# Altium schematic sheet BLDC_Controller.SchDoc: BLDC Controller
size A4; Author: Ian Glass; DrawnBy: Ian Glass; Revision: 1; SheetNumber: 1; SheetTotal: 1
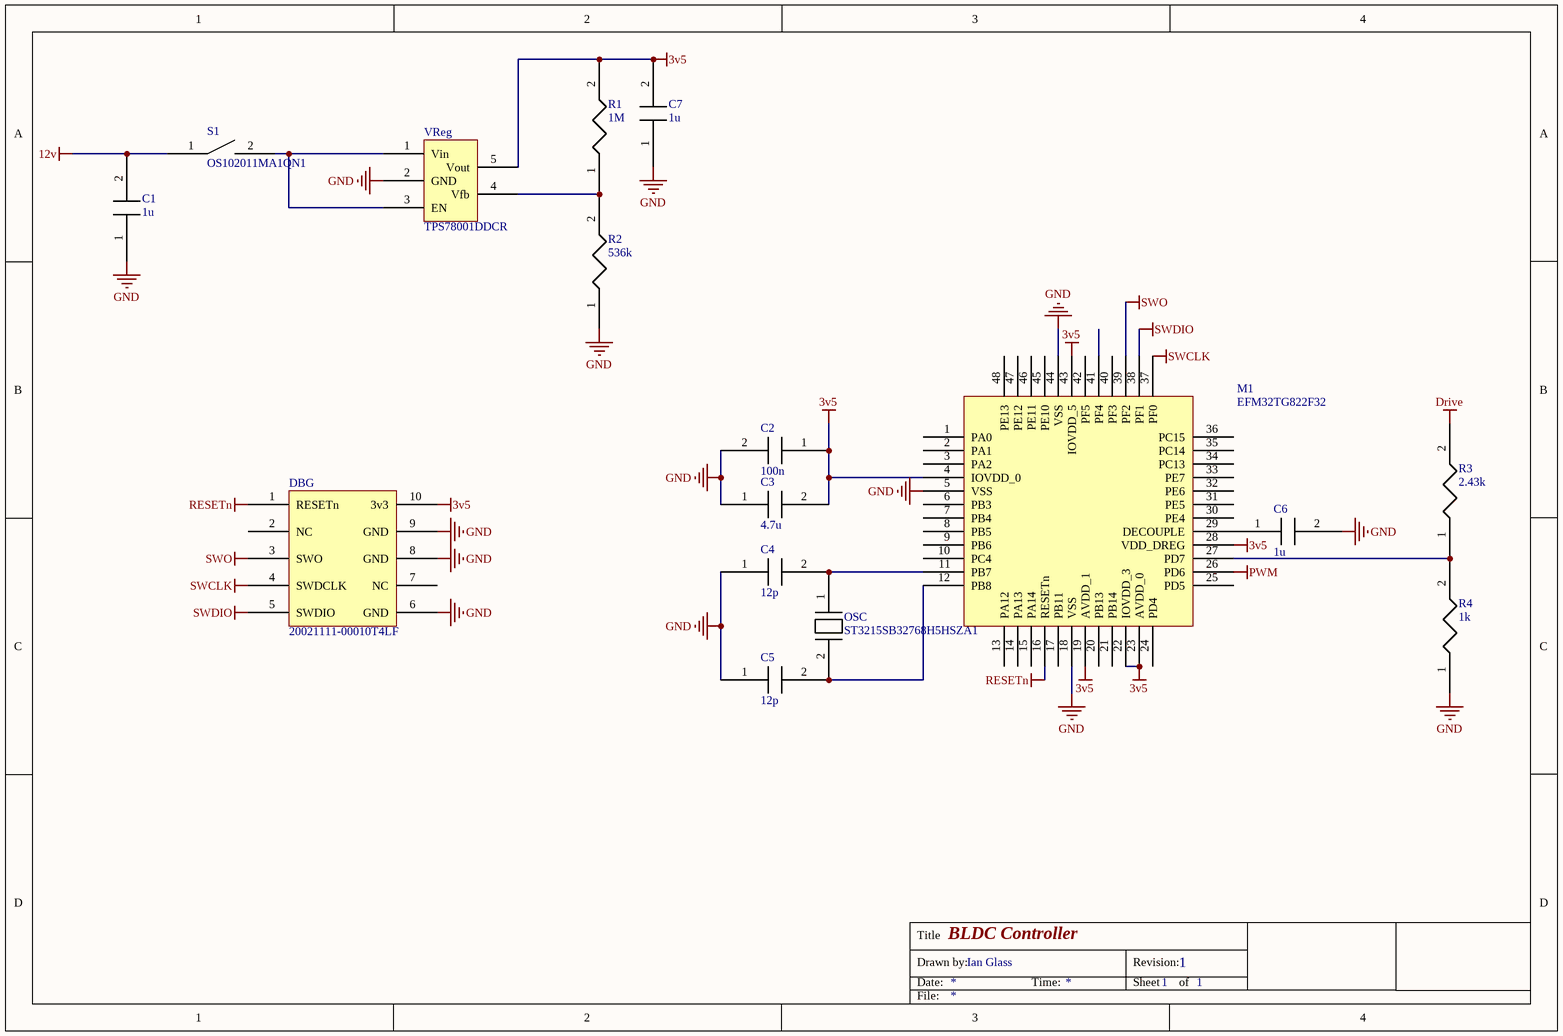
[diagram p0: BLDC_Controller.SchDoc]

## Parts
C1  1u  [Capacitor 0402]
C2  100n  [Capacitor 0402]
C3  4.7u  [Capacitor 0603]
C4  12p  [Capacitor 0402]
C5  12p  [Capacitor 0402]
C6  1u  [Capacitor 0402]
C7  1u  [Capacitor 0402]
DBG  20021111-00010T4LF  [20021111-00010T4LF]
M1  EFM32TG822F32  [EFM32TG822F32]
OSC  ST3215SB32768H5HSZA1  [ST3215SB32768H5HSZA1]
R1  1M  [Resistor 0402]
R2  536k  [Resistor 0603]
R3  2.43k  [Resistor 0603]
R4  1k  [Resistor 0603]
S1  OS102011MA1QN1  [OS102011MA1QN1]
VReg  TPS78001DDCR  [TPS78001DDCR]

## Nets
3v5: C2.1 C3.2 C7.2 DBG.10(3v3) M1.4(IOVDD_0) M1.19(AVDD_1) M1.22(IOVDD_3) M1.23(AVDD_0) M1.28(VDD_DREG) M1.43(IOVDD_5) R1.2 VReg.5(Vout)
12v: C1.2 S1.1
Drive: R3.2
GND: C1.1 C2.2 C3.1 C4.1 C5.1 C6.2 C7.1 DBG.6(GND) DBG.8(GND) DBG.9(GND) M1.5(VSS) M1.18(VSS) M1.44(VSS) R2.1 R4.1 VReg.2(GND)
PWM: M1.26(PD6)
RESETn: DBG.1(RESETn) M1.16(RESETn)
SWCLK: DBG.4(SWDCLK) M1.37(PF0)
SWDIO: DBG.5(SWDIO) M1.38(PF1)
SWO: DBG.3(SWO) M1.39(PF2)
NetC4_2: C4.2 M1.11(PB7) OSC.1
NetC5_2: C5.2 M1.12(PB8) OSC.2
NetC6_1: C6.1 M1.29(DECOUPLE)
NetM1_27: M1.27(PD7) R3.1 R4.2
NetR1_1: R1.1 R2.2 VReg.4(Vfb)
NetS1_2: S1.2 VReg.1(Vin) VReg.3(EN)

Not connected (* = marked no-connect by the designer): DBG 2(NC) 7(NC); M1 1(PA0) 2(PA1) 3(PA2) 6(PB3) 7(PB4) 8(PB5) 9(PB6) 10(PC4) 13(PA12) 14(PA13) 15(PA14) 17(PB11) 20(PB13) 21(PB14) 24(PD4) 25(PD5) 30(PE4) 31(PE5) 32(PE6) 33(PE7) 34(PC13) 35(PC14) 36(PC15) 40(PF3) 41(PF4) 42(PF5) 45(PE10) 46(PE11) 47(PE12) 48(PE13)

## Notes on the sheet
- Title
- Drawn by:
- Date:
- Time:
- Revision:
- Sheet
- of
- File:

## Library data of the parts
C1 C2 C4-C7 = Capacitor 0402
C3 = Capacitor 0603
R1 = Resistor 0402
R2-R4 = Resistor 0603